# EAGLE schematic DRV8835_mini_drive v6 (EAGLE 9.7.0)
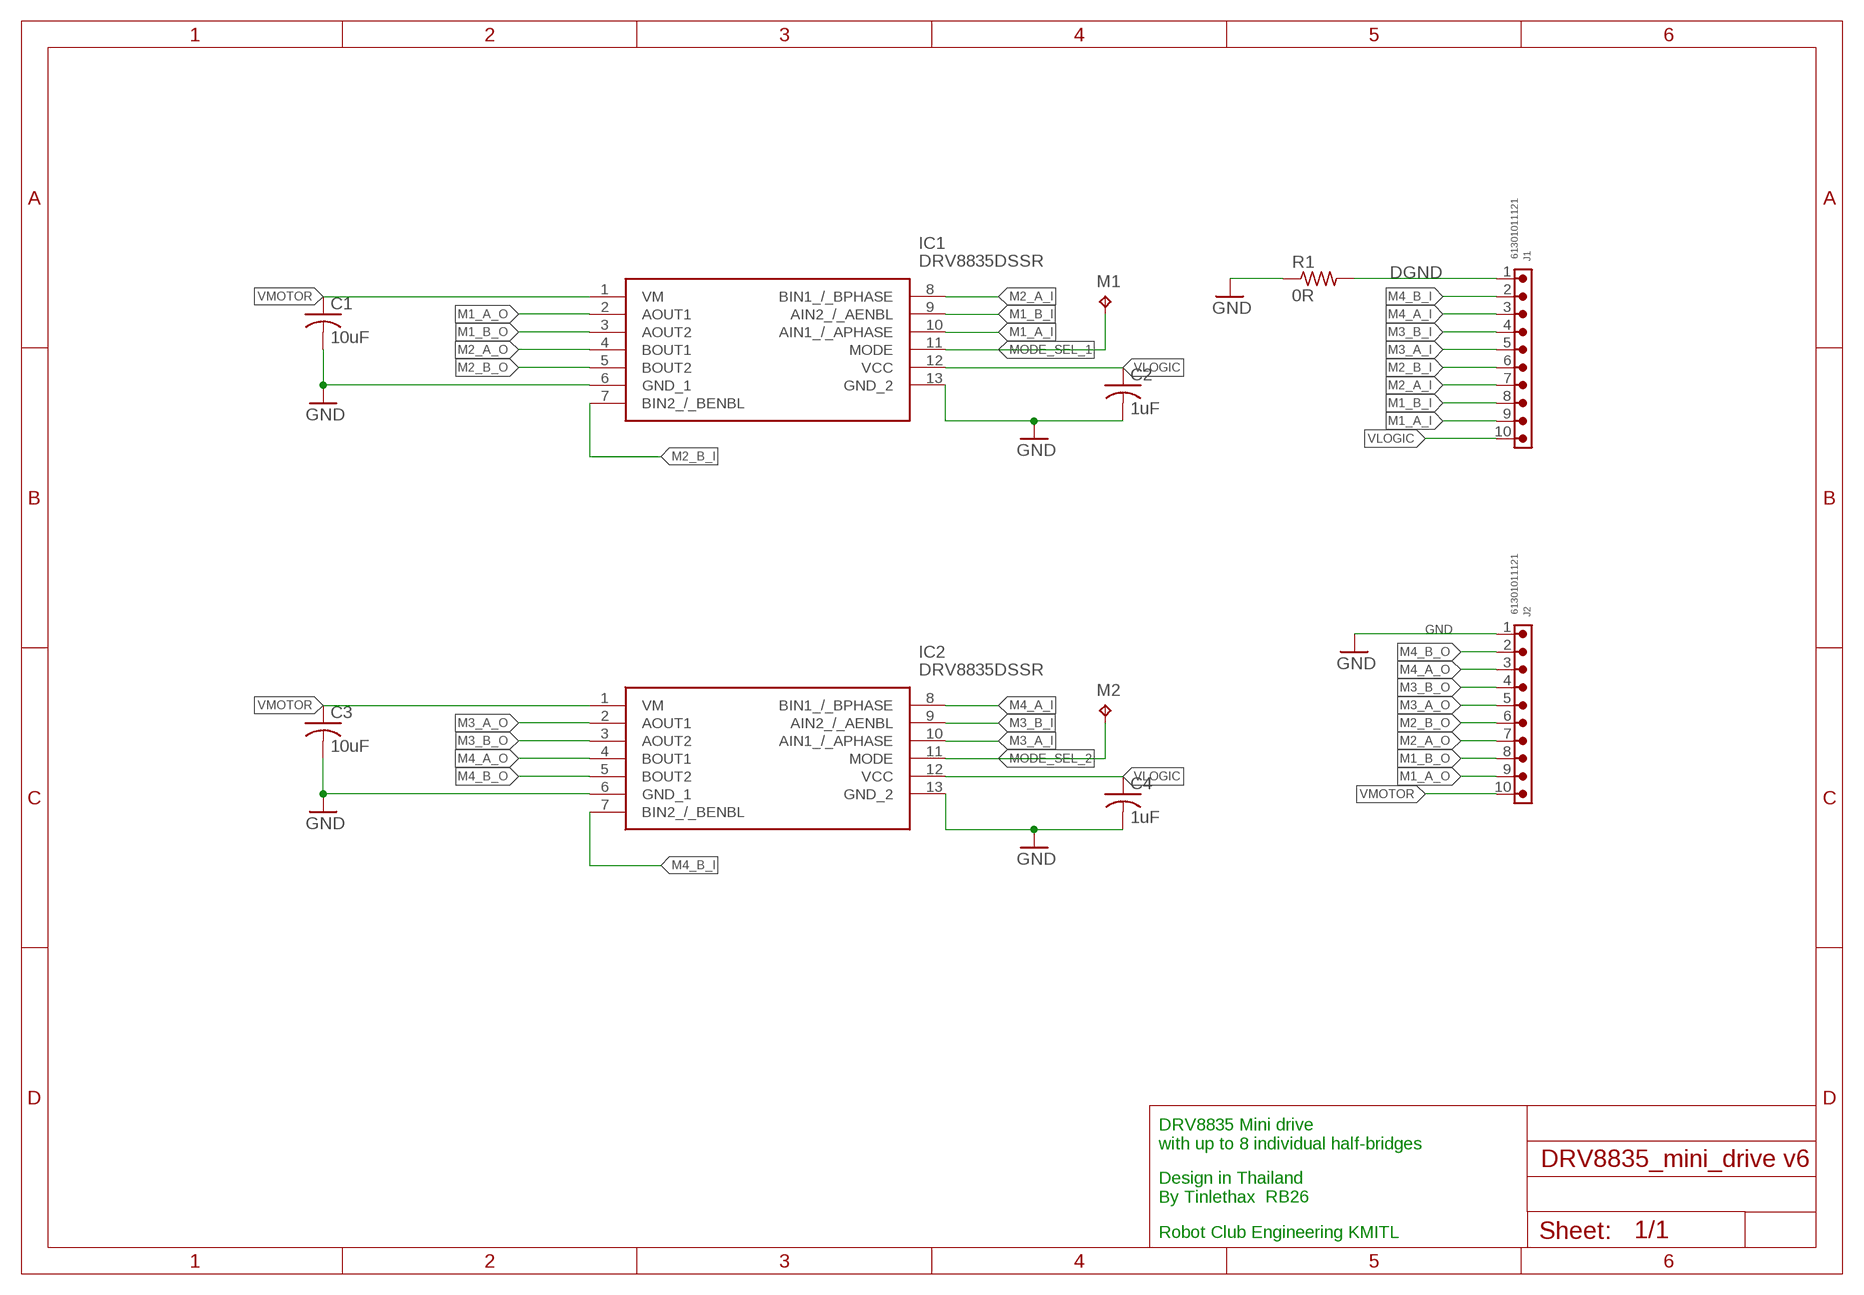
[diagram p0: schematic, sheet 1]

## Parts
C1  10uF  C-USC0603  [C0603]
C2  1uF  C-USC0603  [C0603]
C3  10uF  C-USC0603  [C0603]
C4  1uF  C-USC0603  [C0603]
IC1  DRV8835DSSR  [DRV8835DSSR]
IC2  DRV8835DSSR  [DRV8835DSSR]
J1  61301011121  6130XX11121_61301011121  [61301011121]
J2  61301011121  6130XX11121_61301011121  [61301011121]
M1  TPTP10SQ  [TP10SQ]
M2  TPTP10SQ  [TP10SQ]
R1  0R  R-US_R0805  [R0805]

## Nets
DGND: J1.1 R1.2
GND: C1.2 C2.2 C3.2 C4.2 IC1.6(GND_1) IC1.13(GND_2) IC2.6(GND_1) IC2.13(GND_2) J2.1 R1.1
M1_A_I: IC1.10(AIN1_/_APHASE) J1.9
M1_A_O: IC1.2(AOUT1) J2.9
M1_B_I: IC1.9(AIN2_/_AENBL) J1.8
M1_B_O: IC1.3(AOUT2) J2.8
M2_A_I: IC1.8(BIN1_/_BPHASE) J1.7
M2_A_O: IC1.4(BOUT1) J2.7
M2_B_I: IC1.7(BIN2_/_BENBL) J1.6
M2_B_O: IC1.5(BOUT2) J2.6
M3_A_I: IC2.10(AIN1_/_APHASE) J1.5
M3_A_O: IC2.2(AOUT1) J2.5
M3_B_I: IC2.9(AIN2_/_AENBL) J1.4
M3_B_O: IC2.3(AOUT2) J2.4
M4_A_I: IC2.8(BIN1_/_BPHASE) J1.3
M4_A_O: IC2.4(BOUT1) J2.3
M4_B_I: IC2.7(BIN2_/_BENBL) J1.2
M4_B_O: IC2.5(BOUT2) J2.2
MODE_SEL_1: IC1.11(MODE) M1.TP
MODE_SEL_2: IC2.11(MODE) M2.TP
VLOGIC: C2.1 C4.1 IC1.12(VCC) IC2.12(VCC) J1.10
VMOTOR: C1.1 C3.1 IC1.1(VM) IC2.1(VM) J2.10

## Notes on the sheet
- DRV8835 Mini drive
  with up to 8 individual half-bridges
- Design in Thailand 
  By Tinlethax
- RB26
- Robot Club Engineering KMITL

## Library data of the parts
C1-C4 = adafruit:C-US: CAPACITOR, American symbol
IC1 IC2 = DRV8835DSSR:DRV8835DSSR: Motor / Motion / Ignition Controllers & Drivers 1.5A Low Vlt Stepper Motor Source: Datasheet <http://www.ti.com/general/docs/suppproductinfo.tsp?distId=26&gotoUrl=http://www.ti.com/lit/gpn/drv8835>; ARROW_PART_NUMBER: DRV8835DSSR; ARROW_PRICE-STOCK: https://www.arrow.com/en/products/drv8835dssr/texas-instruments?region=nac; DESCRIPTION: Motor / Motion / Ignition Controllers & Drivers 1.5A Low Vlt Stepper Motor; HEIGHT: 0.8mm; MANUFACTURER_NAME: Texas Instruments; MANUFACTURER_PART_NUMBER: DRV8835DSSR; MOUSER_PART_NUMBER: 595-DRV8835DSSR; MOUSER_PRICE-STOCK: https://www.mouser.co.uk/ProductDetail/Texas-Instruments/DRV8835DSSR?qs=UFc95S4Z4CYjBOyEmbTDlA%3D%3D
J1 J2 = Wurth_Connectors_WR-PHD:6130XX11121_61301011121: WR-PHD 2.54 mm THT Pin Header ARTICLE PROPERTIES: Pins:1;​ 2;​ 3;​ 4;​ 5;​ 6;​ 7;​ 8;​ 9;​ 10;​ 12;​ 13;​ 14;​ 15;​ 16;​ 18;​ 20;​ 22;​ 24;​ 25;​ 32;​ 36;​ 40 KIND PROPERTIES: Pitch：2.54 mm Quality Class:3 as per CECC 75 301-802 Rows：Single Gender：Pin Header Type：Straight MATERIAL PROPERTIES: Insulator Material :PBT Insulator Flammability Rating:UL94 V-0 Contact Material:Copper Alloy Contact Plating:Gold Contact Type:Stamped GENERAL INFORMATION Operating Temperature:-40 up to +105 °C Compliance:RoHS ELECTRICAL PROPERTIES: Rated Current:3 A IR 1:3 A Withstanding Voltage:500 V (AC) Contact Resistance:20 mΩ RISO:1000 MΩ CERTIFICATION UL Approval:E323964 PACKAGING PROPERTIES Packaging:Bag <https://katalog.we-online.com/media/images/v2/o33211v209%20Family_BTB_PHD_6130xx11121.jpg> Details see: https://katalog.we-online.com/en/em/PHD_2_54_THT_PIN_HEADER_6130XX11121 Updated by Yingchun,Shan 2019-10-16 2019 (C) Würth Elektronik; DATASHEET-URL: https://www.we-online.com/catalog/datasheet/61301011121.pdf; GENDER: Pin Header; IR: 3A; MOUNT: THT; PACKAGING: Bag; PART-NUMBER: 61301011121; PINS: 10; PITCH: 2.54mm; ROWS: Single; TYPE: Straight
M1 M2 = testpad:TP: Test pad
R1 = adafruit:R-US_: RESISTOR, American symbol